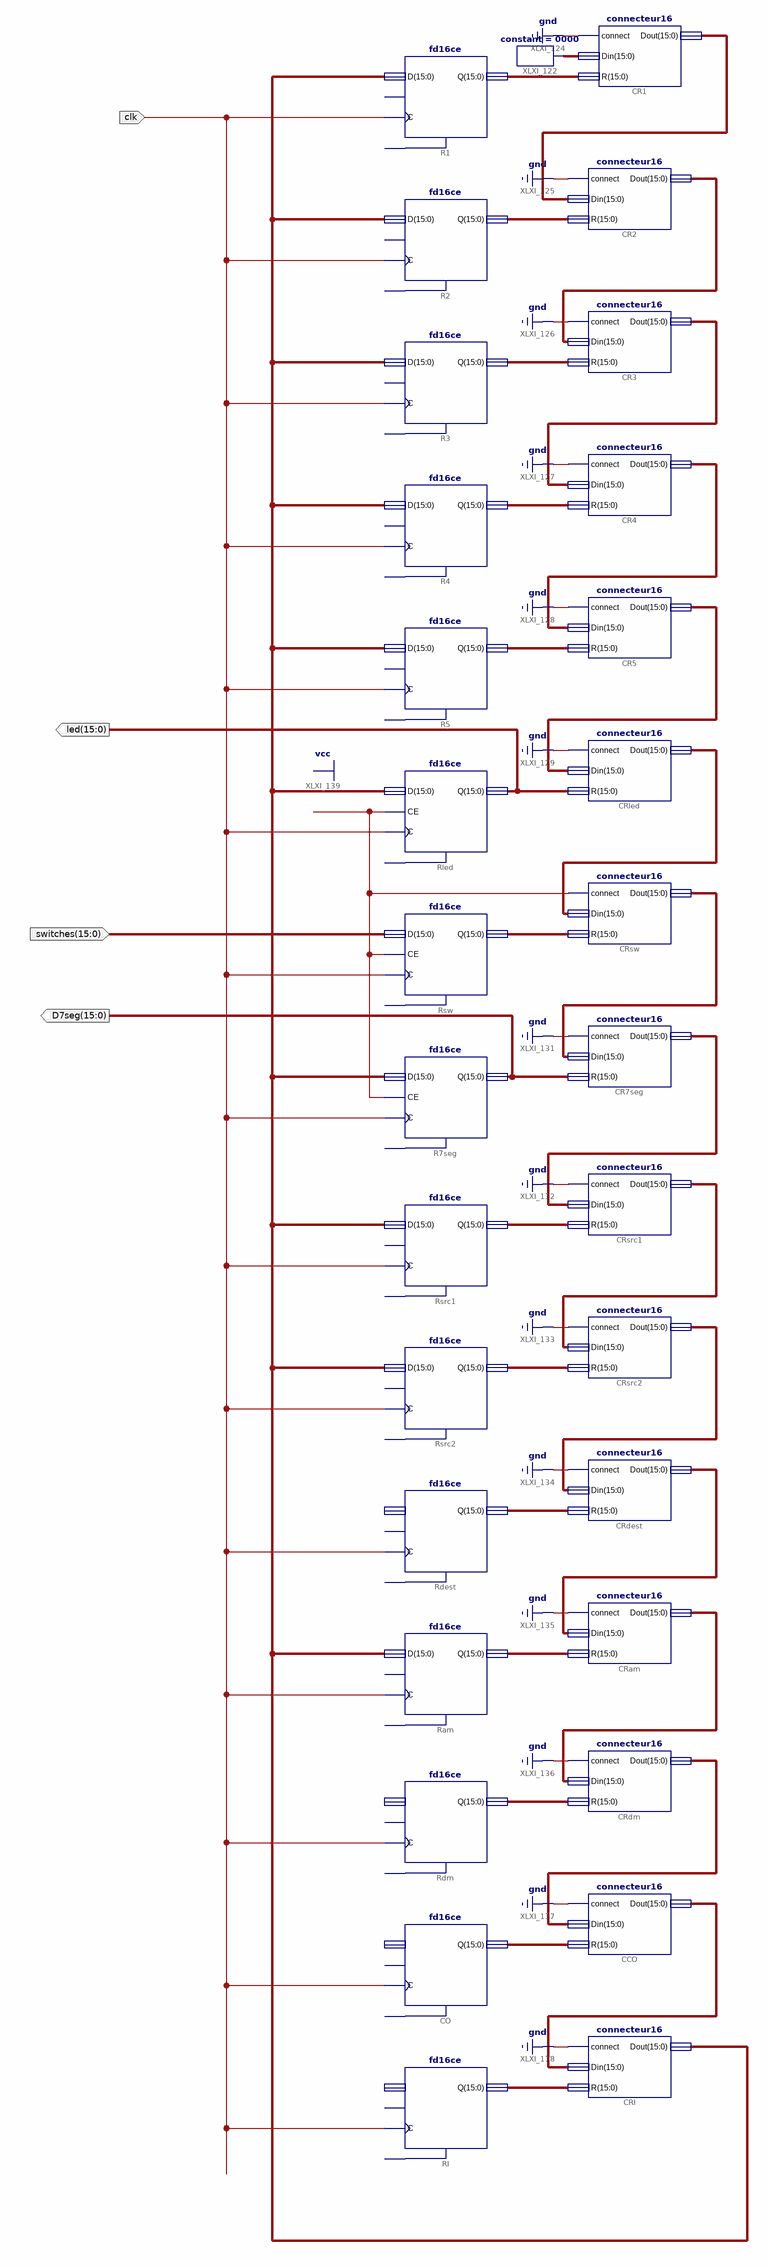
[diagram p0: schematic sheet 1]
// Xilinx ISE schematic S3.sch (spartan3e) as structural Verilog: 31 symbols, 4 ports
module S3 (
  input  clk,
  input  [15:0] switches,
  output [15:0] led,
  output [15:0] D7seg
);

  wire [15:0] XLXN_1, XLXN_2, XLXN_3, XLXN_4, XLXN_5, XLXN_7, XLXN_9, XLXN_10, XLXN_11, XLXN_12, XLXN_13,
       XLXN_14, XLXN_15, XLXN_17, XLXN_33, XLXN_34, XLXN_35, XLXN_36, XLXN_37, XLXN_38, XLXN_39, XLXN_40,
       XLXN_41, XLXN_42, XLXN_43, XLXN_44, XLXN_45, XLXN_46, XLXN_47;

  fd16ce R1 (.C(clk), .D(XLXN_47), .Q(XLXN_1));  // open: CE, CLR
  fd16ce R2 (.C(clk), .D(XLXN_47), .Q(XLXN_2));  // open: CE, CLR
  fd16ce R3 (.C(clk), .D(XLXN_47), .Q(XLXN_3));  // open: CE, CLR
  fd16ce R4 (.C(clk), .D(XLXN_47), .Q(XLXN_4));  // open: CE, CLR
  fd16ce R5 (.C(clk), .D(XLXN_47), .Q(XLXN_5));  // open: CE, CLR
  fd16ce Rled (.C(clk), .CE(1'b1), .D(XLXN_47), .Q(led));  // open: CLR
  fd16ce Rsw (.C(clk), .CE(1'b1), .D(switches), .Q(XLXN_7));  // open: CLR
  fd16ce R7seg (.C(clk), .CE(1'b1), .D(XLXN_47), .Q(D7seg));  // open: CLR
  fd16ce Rsrc1 (.C(clk), .D(XLXN_47), .Q(XLXN_9));  // open: CE, CLR
  fd16ce Rsrc2 (.C(clk), .D(XLXN_47), .Q(XLXN_10));  // open: CE, CLR
  fd16ce Rdest (.C(clk), .Q(XLXN_11));  // open: CE, CLR, D
  fd16ce Ram (.C(clk), .D(XLXN_47), .Q(XLXN_12));  // open: CE, CLR
  fd16ce Rdm (.C(clk), .Q(XLXN_13));  // open: CE, CLR, D
  fd16ce CO (.C(clk), .Q(XLXN_14));  // open: CE, CLR, D
  fd16ce RI (.C(clk), .Q(XLXN_15));  // open: CE, CLR, D
  connecteur16 CR1 (.connect(1'b0), .Din(XLXN_17), .R(XLXN_1), .Dout(XLXN_33));
  connecteur16 CR2 (.connect(1'b0), .Din(XLXN_33), .R(XLXN_2), .Dout(XLXN_34));
  connecteur16 CR3 (.connect(1'b0), .Din(XLXN_34), .R(XLXN_3), .Dout(XLXN_35));
  connecteur16 CR4 (.connect(1'b0), .Din(XLXN_35), .R(XLXN_4), .Dout(XLXN_36));
  connecteur16 CR5 (.connect(1'b0), .Din(XLXN_36), .R(XLXN_5), .Dout(XLXN_37));
  connecteur16 CRled (.connect(1'b0), .Din(XLXN_37), .R(led), .Dout(XLXN_38));
  connecteur16 CRsw (.connect(1'b1), .Din(XLXN_38), .R(XLXN_7), .Dout(XLXN_39));
  connecteur16 CR7seg (.connect(1'b0), .Din(XLXN_39), .R(D7seg), .Dout(XLXN_40));
  connecteur16 CRsrc1 (.connect(1'b0), .Din(XLXN_40), .R(XLXN_9), .Dout(XLXN_41));
  connecteur16 CRsrc2 (.connect(1'b0), .Din(XLXN_41), .R(XLXN_10), .Dout(XLXN_42));
  connecteur16 CRdest (.connect(1'b0), .Din(XLXN_42), .R(XLXN_11), .Dout(XLXN_43));
  connecteur16 CRam (.connect(1'b0), .Din(XLXN_43), .R(XLXN_12), .Dout(XLXN_44));
  connecteur16 CRdm (.connect(1'b0), .Din(XLXN_44), .R(XLXN_13), .Dout(XLXN_45));
  connecteur16 CCO (.connect(1'b0), .Din(XLXN_45), .R(XLXN_14), .Dout(XLXN_46));
  connecteur16 CRI (.connect(1'b0), .Din(XLXN_46), .R(XLXN_15), .Dout(XLXN_47));
  constant #(.CValue("0000")) XLXI_122 (.O(XLXN_17));
endmodule
